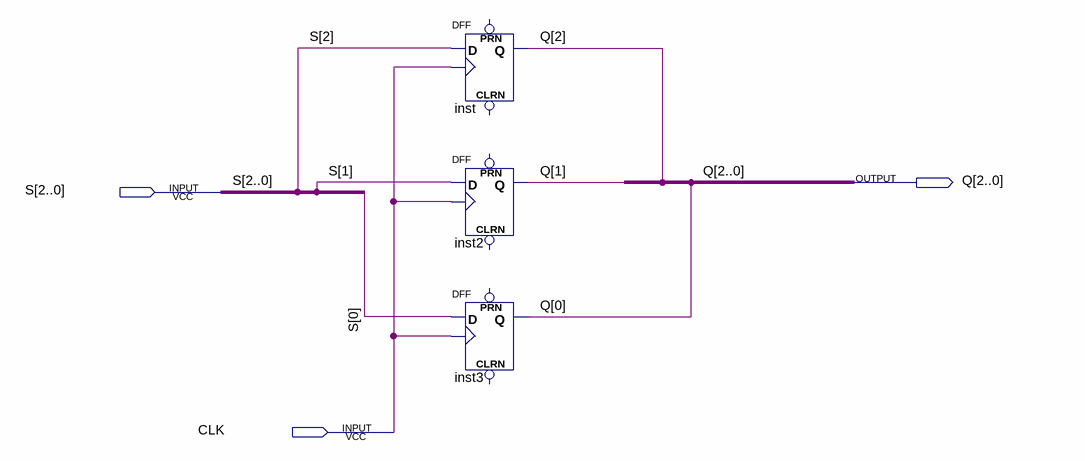
[diagram p0: schematic sheet]
// Quartus schematic ThreeBitRegister.bdf as structural Verilog: 3 symbols, 3 pins
module ThreeBitRegister (
  input  [2:0] S,
  input  CLK,
  output [2:0] Q
);

  DFF inst (.CLK(CLK), .D(S[2]), .Q(Q[2]));  // open: CLRN, PRN
  DFF inst2 (.CLK(CLK), .D(S[1]), .Q(Q[1]));  // open: CLRN, PRN
  DFF inst3 (.CLK(CLK), .D(S[0]), .Q(Q[0]));  // open: CLRN, PRN
endmodule
